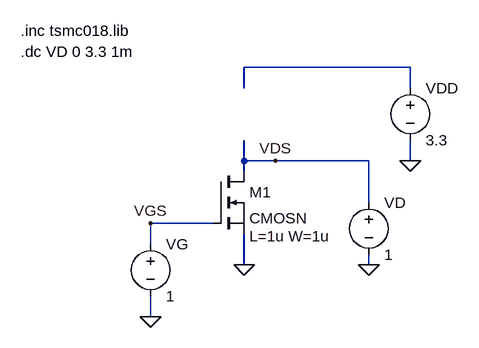
[diagram p0: schematic q1_lambda.asc]
q1_lambda.asc, the LTspice schematic file:
Version 4.1
SHEET 1 880 680
WIRE 480 32 224 32
WIRE 224 64 224 32
WIRE 480 64 480 32
WIRE 224 176 224 144
WIRE 272 176 224 176
WIRE 416 176 272 176
WIRE 480 176 480 144
WIRE 224 192 224 176
WIRE 416 240 416 176
WIRE 176 272 80 272
WIRE 80 304 80 272
WIRE 224 336 224 288
WIRE 416 336 416 320
WIRE 80 416 80 384
FLAG 480 176 0
FLAG 224 336 0
FLAG 80 272 VGS
FLAG 272 176 VDS
FLAG 80 416 0
FLAG 416 336 0
SYMBOL nmos 176 192 R0
WINDOW 123 56 100 Left 2
SYMATTR Value2 L=1u W=1u
SYMATTR InstName M1
SYMATTR Value CMOSN
SYMBOL voltage 480 48 R0
WINDOW 123 0 0 Left 0
WINDOW 39 0 0 Left 0
SYMATTR InstName VDD
SYMATTR Value 3.3
SYMBOL voltage 80 288 R0
WINDOW 123 0 0 Left 0
WINDOW 39 0 0 Left 0
SYMATTR InstName VG
SYMATTR Value 1
SYMBOL voltage 416 224 R0
WINDOW 123 0 0 Left 0
WINDOW 39 0 0 Left 0
SYMATTR InstName VD
SYMATTR Value 1
TEXT -120 -24 Left 2 !.inc tsmc018.lib
TEXT -120 8 Left 2 !.dc VD 0 3.3 1m

The netlist it stands for:
* q1_lambda.asc
M1 VDS VGS 0 0 CMOSN L=1u W=1u
VDD N001 0 3.3
VG VGS 0 1
VD VDS 0 1
.model NMOS NMOS
.model PMOS PMOS
.lib standard.mos
.inc tsmc018.lib
.dc VD 0 3.3 1m
.backanno
.end

* Results of the author's LTspice run, read from the files saved beside the schematic
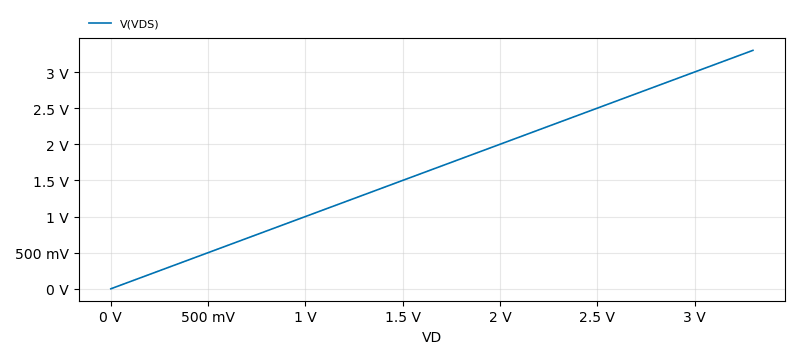
[diagram p1: DC transfer characteristic of q1_lambda.asc, plotted from the saved traces]
* DC transfer characteristic, 1 run:
*   V(VDS): 0 V at VD=0 V, 3.3 V at VD=3.3 V, min 0 V, max 3.3 V